# Altium schematic sheet temparature sensor.SchDoc
size A
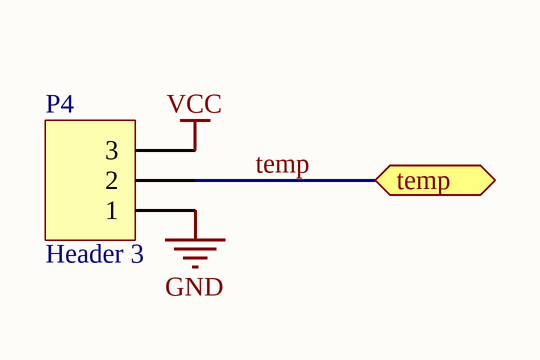
[diagram p0: temparature sensor.SchDoc]

## Parts
P4  Header 3  [3pin connector]

## Ports
temp (bidir)

## Nets
GND: P4.1
VCC: P4.3
temp: P4.2 ; port temp

## Library data of the parts
P4 = Header 3: Header, 3-Pin; LatestRevisionDate: 17-Jul-2002; LatestRevisionNote: Re-released for DXP Platform.; Publisher: Altium Limited